# Altium project UV_Disinfection_Hw00.PrjPcb
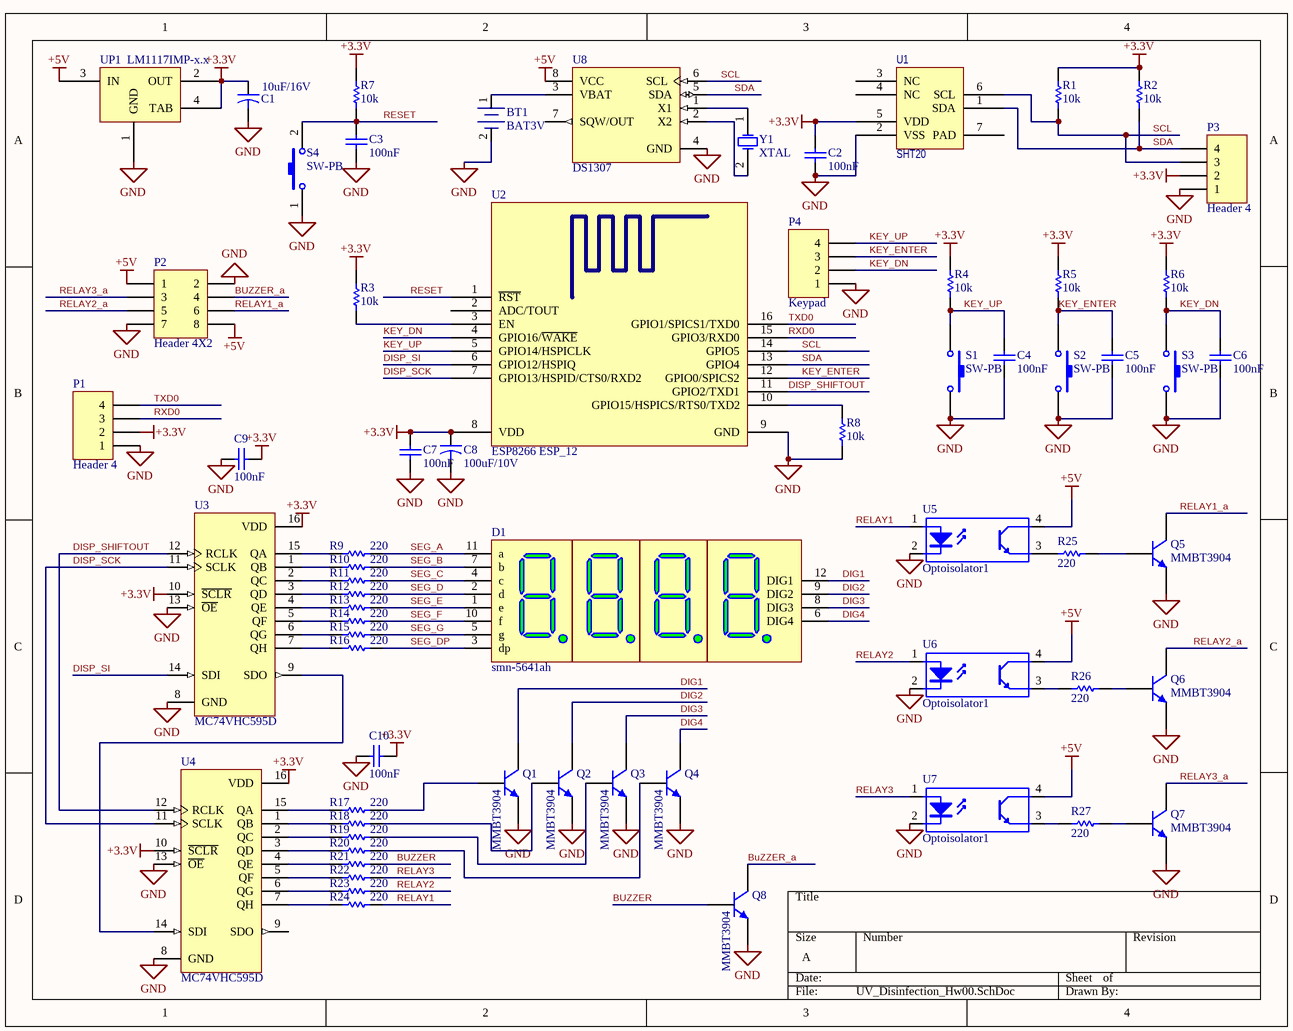
[diagram p0: UV_Disinfection_Hw00.SchDoc]
1 sheet, 65 parts. Net scope: global (net labels, ports and power ports of the same name join across sheets).
Board file: UV_Disinfection_Hw00.PcbDoc

## Sheet UV_Disinfection_Hw00.SchDoc
size A

### Parts
BT1  BAT3V  [BTH1220_smd]
C1  10uF/16V  [CAP_EL_SMD_4x5.3]
C2  100nF  [CAP0603]
C3  100nF  [CAP0603]
C4  100nF  [CAP0603]
C5  100nF  [CAP0603]
C6  100nF  [CAP0603]
C7  100nF  [CAP0603]
C8  100uF/10V  [CAP_EL_SMD_4x5.3]
C9  100nF  [CAP0603]
C10  100nF  [CAP0603]
D1  smn-5641ah  [7SEG-4DIGIT-50x19]
P1  Header 4  [HDR1X4]
P2  Header 4X2  [HDR2X4]
P3  Header 4  [XH-4PIN-RA]
P4  Keypad  [HDR1X4]
Q1  MMBT3904  [SOT23_N]
Q2  MMBT3904  [SOT23_N]
Q3  MMBT3904  [SOT23_N]
Q4  MMBT3904  [SOT23_N]
Q5  MMBT3904  [SOT23_N]
Q6  MMBT3904  [SOT23_N]
Q7  MMBT3904  [SOT23_N]
Q8  MMBT3904  [SOT23_N]
R1  10k  [RES0805]
R2  10k  [RES0805]
R3  10k  [RES0805]
R4  10k  [RES0805]
R5  10k  [RES0805]
R6  10k  [RES0805]
R7  10k  [RES0805]
R8  10k  [RES0805]
R9  220  [RES0603]
R10  220  [RES0603]
R11  220  [RES0603]
R12  220  [RES0603]
R13  220  [RES0603]
R14  220  [RES0603]
R15  220  [RES0603]
R16  220  [RES0603]
R17  220  [RES0603]
R18  220  [RES0603]
R19  220  [RES0603]
R20  220  [RES0603]
R21  220  [RES0603]
R22  220  [RES0603]
R23  220  [RES0603]
R24  220  [RES0603]
R25  220  [RES0603]
R26  220  [RES0603]
R27  220  [RES0603]
S1  SW-PB  [SW-4PIN]
S2  SW-PB  [SW-4PIN]
S3  SW-PB  [SW-4PIN]
S4  SW-PB  [SW-2PIN-SMD]
U1  SHT20  [SHT20]
U2  ESP8266 ESP_12  [ESP8266 ESP_12]
U3  MC74VHC595D  [751B-05_N]
U4  MC74VHC595D  [751B-05_N]
U5  Optoisolator1  [DIP_4]
U6  Optoisolator1  [DIP_4]
U7  Optoisolator1  [DIP_4]
U8  DS1307  [DIP-8]
UP1  LM1117IMP-x.x  [SOT223_4]
Y1  XTAL  [Crystal_NC308]

### Nets
+3.3V: C1.1 C2.2 C7.2 C8.1 C9.1 C10.1 P1.2 P3.2 R1.2 R2.2 R3.2 R4.2 R5.2 R6.2 R7.2 U1.5(VDD) U2.8(VDD) U3.10(~{SCLR}) U3.16(VDD) U4.10(~{SCLR}) U4.16(VDD) UP1.2(OUT) UP1.4(TAB)
+5V: P2.1 P2.8 U5.4(C) U6.4(C) U7.4(C) U8.8(VCC) UP1.3(IN)
GND: BT1.2(-) C1.2 C2.1 C3.1 C4.1 C5.1 C6.1 C7.1 C8.2 C9.2 C10.2 P1.1 P2.2 P2.7 P3.1 P4.1 Q1.2(E) Q2.2(E) Q3.2(E) Q4.2(E) Q5.2(E) Q6.2(E) Q7.2(E) Q8.2(E) R8.1 S1.2 S2.2 S3.2 S4.1 U1.2(VSS) U2.9(GND) U3.8(GND) U3.13(~{OE}) U4.8(GND) U4.13(~{OE}) U5.2(K) U6.2(K) U7.2(K) U8.4(GND) UP1.1(GND)
BUZZER: Q8.1(B) R21.1
BUZZER_a: P2.4 Q8.3(C)
DIG1: D1.12(DIG1) Q1.3(C)
DIG2: D1.9(DIG2) Q2.3(C)
DIG3: D1.8(DIG3) Q3.3(C)
DIG4: D1.6(DIG4) Q4.3(C)
DISP_SCK: U2.7(GPIO13/HSPID/CTS0/RXD2) U3.11(SCLK) U4.11(SCLK)
DISP_SHIFTOUT: U2.11(GPIO2/TXD1) U3.12(RCLK) U4.12(RCLK)
DISP_SI: U2.6(GPIO12/HSPIQ) U3.14(SDI)
KEY_DN: C6.2 P4.2 R6.1 S3.1 U2.4(GPIO16/~{WAKE})
KEY_ENTER: C5.2 P4.3 R5.1 S2.1 U2.12(GPIO0/SPICS2)
KEY_UP: C4.2 P4.4 R4.1 S1.1 U2.5(GPIO14/HSPICLK)
RELAY1: R24.1 U5.1(A)
RELAY1_a: P2.6 Q5.3(C)
RELAY2: R23.1 U6.1(A)
RELAY2_a: P2.5 Q6.3(C)
RELAY3: R22.1 U7.1(A)
RELAY3_a: P2.3 Q7.3(C)
RESET: C3.2 R7.1 S4.2 U2.1(~{RST})
RXD0: P1.3 U2.15(GPIO3/RXD0)
SCL: P3.3 R1.1 U1.6(SCL) U2.14(GPIO5) U8.6(SCL)
SDA: P3.4 R2.1 U1.1(SDA) U2.13(GPIO4) U8.5(SDA)
SEG_A: D1.11(a) R9.1
SEG_B: D1.7(b) R10.1
SEG_C: D1.4(c) R11.1
SEG_D: D1.2(d) R12.1
SEG_DP: D1.3(dp) R16.1
SEG_E: D1.1(e) R13.1
SEG_F: D1.10(f) R14.1
SEG_G: D1.5(g) R15.1
TXD0: P1.4 U2.16(GPIO1/SPICS1/TXD0)
NetBT1_1: BT1.1(+) U8.3(VBAT)
NetQ1_1: Q1.1(B) R17.1
NetQ2_1: Q2.1(B) R18.1
NetQ3_1: Q3.1(B) R19.1
NetQ4_1: Q4.1(B) R20.1
NetQ5_1: Q5.1(B) R25.2
NetQ6_1: Q6.1(B) R26.2
NetQ7_1: Q7.1(B) R27.2
NetR3_1: R3.1 U2.3(EN)
NetR8_2: R8.2 U2.10(GPIO15/HSPICS/RTS0/TXD2)
NetR9_2: R9.2 U3.15(QA)
NetR10_2: R10.2 U3.1(QB)
NetR11_2: R11.2 U3.2(QC)
NetR12_2: R12.2 U3.3(QD)
NetR13_2: R13.2 U3.4(QE)
NetR14_2: R14.2 U3.5(QF)
NetR15_2: R15.2 U3.6(QG)
NetR16_2: R16.2 U3.7(QH)
NetR17_2: R17.2 U4.15(QA)
NetR18_2: R18.2 U4.1(QB)
NetR19_2: R19.2 U4.2(QC)
NetR20_2: R20.2 U4.3(QD)
NetR21_2: R21.2 U4.4(QE)
NetR22_2: R22.2 U4.5(QF)
NetR23_2: R23.2 U4.6(QG)
NetR24_2: R24.2 U4.7(QH)
NetR25_1: R25.1 U5.3(E)
NetR26_1: R26.1 U6.3(E)
NetR27_1: R27.1 U7.3(E)
NetU3_9: U3.9(SDO) U4.14(SDI)
NetU8_1: U8.1(X1) Y1.1(OSC1)
NetU8_2: U8.2(X2) Y1.2(OSC2)

Not connected (* = marked no-connect by the designer): U1 3(NC) 4(NC) 7(_PAD); U2 2(ADC/TOUT); U4 9(SDO); U8 7(SQW/OUT)

### Library data of the parts
BT1 = Battry Backup: Designer: Abbas Basereh; Data: 16-12-2016; Link: *; Part. No: *
C1 C8 = Cap2: Capacitor; Published: 23-Sep-2002; PackageReference: CAPR5-4X5; Publisher: Altium Limited; PackageDescription: Capacitor; 2 Leads
  C1: Value: 10uF/16V
  C8: Value: 100uF/10V
C2-C7 C9 C10 = Cap: Capacitor; Published: 8-Jun-2000; LatestRevisionDate: 17-Jul-2002; LatestRevisionNote: Re-released for DXP Platform.; PackageReference: RAD-0.3; Publisher: Altium Limited; PackageDescription: Radial Cap, Thru-Hole; 2 Leads; 0.3 in Pin Spacing; Value: 100nF
D1 = 7SEG-4DIGIT-12PIN: CC-4digit-7Seg-12PIN
P1 P3 P4 = Header 4: Header, 4-Pin; LatestRevisionDate: 17-Jul-2002; LatestRevisionNote: Re-released for DXP Platform.; Publisher: Altium Limited
P2 = Header 4X2: Header, 4-Pin, Dual row; LatestRevisionDate: 17-Jul-2002; LatestRevisionNote: Re-released for DXP Platform.; Publisher: Altium Limited
Q1-Q8 = MMBT3904: NPN Switching Transistor; Published: 17-Sep-2003; LatestRevisionDate: 12-Dec-2006; LatestRevisionNote: IPC-7351 Footprint Added.; DatasheetVersion: 13-May-2002; PackageVersion: May-1999; PackageReference: SOT23; Publisher: Altium Limited; PackageDescription: 3-Pin SOT-23 Package 0.95 mm Pitch, 2.3 mm Lead Span; ComponentLink1Description: Manufacturer Link; ComponentLink1URL: http://www.semiconductors.philips.com/; ComponentLink2Description: Datasheet; ComponentLink2URL: http://www.semiconductors.philips.com/acrobat/datasheets/MMBT3904_4.pdf
R1-R27 = Res1: Resistor; Published: 8-Jun-2000; LatestRevisionDate: 17-Jul-2002; LatestRevisionNote: Re-released for DXP Platform.; PackageReference: AXIAL-0.3; Publisher: Altium Limited; PackageDescription: Axial Device, Thru-Hole; 2 Leads; 0.3 in Pin Spacing
  R1-R8: Value: 10k
  R9-R27: Value: 220
S1-S4 = SW-PB: Switch; Published: 24-Mar-1999; LatestRevisionDate: 17-Jul-2002; LatestRevisionNote: Re-released for DXP Platform.; PackageReference: SPST-2; Publisher: Altium Limited; PackageDescription: Switch; 2 Leads
U1 = SHT20: Humidty Sensor I2C
U2 = ESP8266 ESP_12: ESP8266 ESP-12; IC: ESP8266-EX; Vendor: Ai-thinker; LatestReviewer: Zion Blue; Published: 14-Apr-2015; Publisher: Cynetik Group; LatestRevisionData: 14-Apr-2015; LatestRevisionNote: Include 3D body and Footprint
U3 U4 = MC74VHC595D: 8-Bit 3-State Shift Register with Output Storage Register; ComponentAvailability: Not for New Design; Published: 15-Apr-2002; LatestRevisionDate: 13-Apr-2006; LatestRevisionNote: IPC-7351 Footprint Added.; DatasheetVersion: 1997; PackageVersion: Oct-1999; PackageReference: 751B-05; Publisher: Altium Limited; PackageDescription: 16-Pin Small Outline Integrated Circuit 1.27 mm Pitch; Code_JEDEC: MS-012-AC; Code_IPC: SOIC127P600-16; ComponentLink1Description: Manufacturer Link; ComponentLink1URL: http://www.onsemi.com/; ComponentLink2Description: Datasheet; ComponentLink2URL: http://www.onsemi.com/pub/Collateral/MC74VHC595-D.PDF
U5-U7 = Optoisolator1: 4-Pin Phototransistor Optocoupler; Published: 24-Mar-1999; LatestRevisionDate: 04-Mar-2005; LatestRevisionNote: Sch pins 3 & 4 Swapped.; DatasheetVersion: Nov-2003; PackageReference: DIP-4; Publisher: Altium Limited
U8 = DS1307: 64 X 8 Serial Real-Time Clock; Published: 13-Oct-2000; LatestRevisionDate: 17-Jul-2002; LatestRevisionNote: Re-released for DXP Platform.; DatasheetVersion: 10-Aug-1999; PackageVersion: 1999; PackageReference: DIP8; Publisher: Altium Limited; PackageDescription: DIP, 8-Pin, Row Spacing 7.62 mm, Pitch 2.54 mm; ComponentLink1Description: Manufacturer Link; ComponentLink1URL: http://www.maxim-ic.com/; ComponentLink2Description: Datasheet; ComponentLink2URL: http://pdfserv.maxim-ic.com/en/ds/DS1307.pdf; ComponentLink3Description: Discontinuation Notice; ComponentLink3URL: http://www.maxim-ic.com/qa/pdfs/non-obsolescence-letter.pdf
UP1 = LM1117IMP-x.x: x.x Volt, 800mA Low-Dropout Linear Regulator, 4-pin SOT-223; Designer: Abbas Basereh; Data: 16-12-2016; VALUE: LM1117IMP-x.x
Y1 = XTAL: Crystal Oscillator; Published: 8-Jun-2000; LatestRevisionDate: 17-Jul-2002; LatestRevisionNote: Re-released for DXP Platform.; PackageReference: R38; Publisher: Altium Limited; PackageDescription: Crystal, Thru-Hole; 2 Leads; Body 3.1 x 8.2 mm (Dia.xH)